# EAGLE schematic esp-01-test (EAGLE 7.4.0)
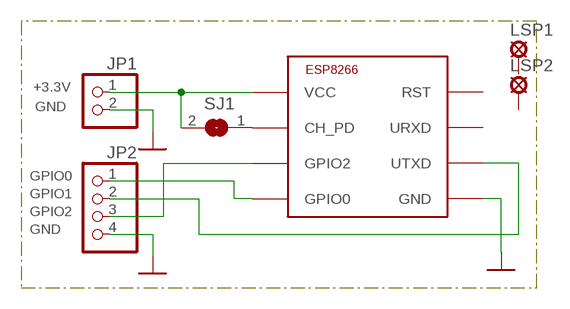
[diagram p0: schematic, sheet 1]

## Parts
JP1  PINHD-1X2  [1X02]
JP2  PINHD-1X4  [1X04]
LSP1  SE14  [SE14]
LSP2  SE14  [SE14]
SJ1  SJ  [SJ]
U$1  ESP8266-01  [ESP-01]

## Nets
GND: JP1.2 JP2.4 U$1.P$8(GND)
N$1: JP2.2 U$1.P$1(UTXD)
N$2: SJ1.1 U$1.P$2(CH_PD)
N$3: JP1.1 SJ1.2 U$1.P$4(VCC)
N$4: JP2.3 U$1.P$7(GPIO2)
N$5: JP2.1 U$1.P$6(GPIO0)
Unconnected: LSP1.MP LSP2.MP U$1.P$3(RST) U$1.P$5(URXD)

## Notes on the sheet
- +3.3V
- GND
- GPIO0
- GPIO1
- GPIO2
- GND

## Library data of the parts
JP1 = pinhead:PINHD-1X2: PIN HEADER
JP2 = pinhead:PINHD-1X4: PIN HEADER
LSP1 LSP2 = solpad:SE14: SOLDER PAD E1553, drill 1,4mm, distributor Buerklin, 07F820
SJ1 = jumper:SJ: SMD solder JUMPER
U$1 = #ESP8266:ESP8266-01: ESP8266 - ESP-01 Module